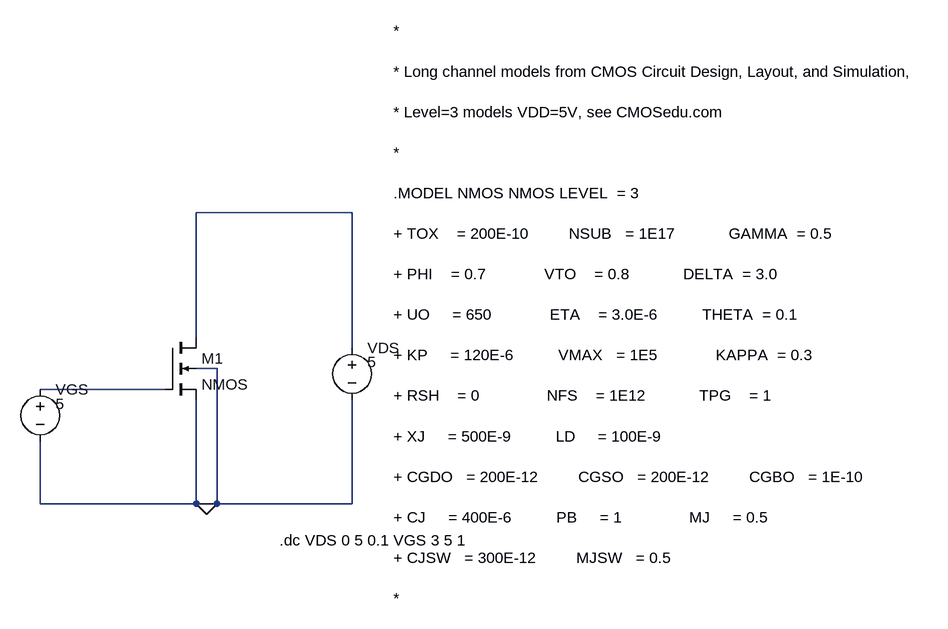
[diagram p0: schematic Draft2.asc]
Draft2.asc, the LTspice schematic file:
Version 4
SHEET 1 1576 680
WIRE 688 0 448 0
WIRE 448 192 448 0
WIRE 688 208 688 0
WIRE 480 240 448 240
WIRE 400 272 208 272
WIRE 208 448 208 352
WIRE 448 448 448 288
WIRE 448 448 208 448
WIRE 464 448 448 448
WIRE 480 448 480 240
WIRE 480 448 464 448
WIRE 688 448 688 288
WIRE 688 448 480 448
FLAG 464 448 0
SYMBOL nmos4 400 192 R0
SYMATTR InstName M1
SYMBOL voltage 208 256 R0
WINDOW 3 24 38 Left 2
SYMATTR InstName VGS
SYMATTR Value 5
SYMBOL voltage 688 192 R0
WINDOW 3 24 38 Left 2
SYMATTR InstName VDS
SYMATTR Value 5
TEXT 576 504 Left 2 !.dc VDS 0 5 0.1 VGS 3 5 1
TEXT 752 -280 Left 2 !*\n\n* Long channel models from CMOS Circuit Design, Layout, and Simulation,\n\n* Level=3 models VDD=5V, see CMOSedu.com\n\n*                                                                   \n\n.MODEL NMOS NMOS LEVEL  = 3                  \n\n+ TOX    = 200E-10         NSUB   = 1E17            GAMMA  = 0.5          \n\n+ PHI    = 0.7             VTO    = 0.8            DELTA  = 3.0         \n\n+ UO     = 650             ETA    = 3.0E-6          THETA  = 0.1          \n\n+ KP     = 120E-6          VMAX   = 1E5             KAPPA  = 0.3                \n\n+ RSH    = 0               NFS    = 1E12            TPG    = 1                  \n\n+ XJ     = 500E-9          LD     = 100E-9                 \n\n+ CGDO   = 200E-12         CGSO   = 200E-12         CGBO   = 1E-10              \n\n+ CJ     = 400E-6          PB     = 1               MJ     = 0.5           \n\n+ CJSW   = 300E-12         MJSW   = 0.5                                  \n\n*

The netlist it stands for:
* Draft2.asc
M1 N001 N002 0 0 NMOS
VGS N002 0 5
VDS N001 0 5
.model NMOS NMOS
.model PMOS PMOS
.lib standard.mos
.dc VDS 0 5 0.1 VGS 3 5 1
*
* Long channel models from CMOS Circuit Design, Layout, and Simulation,
* Level=3 models VDD=5V, see CMOSedu.com
*
.MODEL NMOS NMOS LEVEL  = 3
+ TOX    = 200E-10         NSUB   = 1E17            GAMMA  = 0.5
+ PHI    = 0.7             VTO    = 0.8            DELTA  = 3.0
+ UO     = 650             ETA    = 3.0E-6          THETA  = 0.1
+ KP     = 120E-6          VMAX   = 1E5             KAPPA  = 0.3
+ RSH    = 0               NFS    = 1E12            TPG    = 1
+ XJ     = 500E-9          LD     = 100E-9
+ CGDO   = 200E-12         CGSO   = 200E-12         CGBO   = 1E-10
+ CJ     = 400E-6          PB     = 1               MJ     = 0.5
+ CJSW   = 300E-12         MJSW   = 0.5
*
.backanno
.end